# EAGLE design 8x8 (EAGLE 5.10)

## Sheet 1 of 5
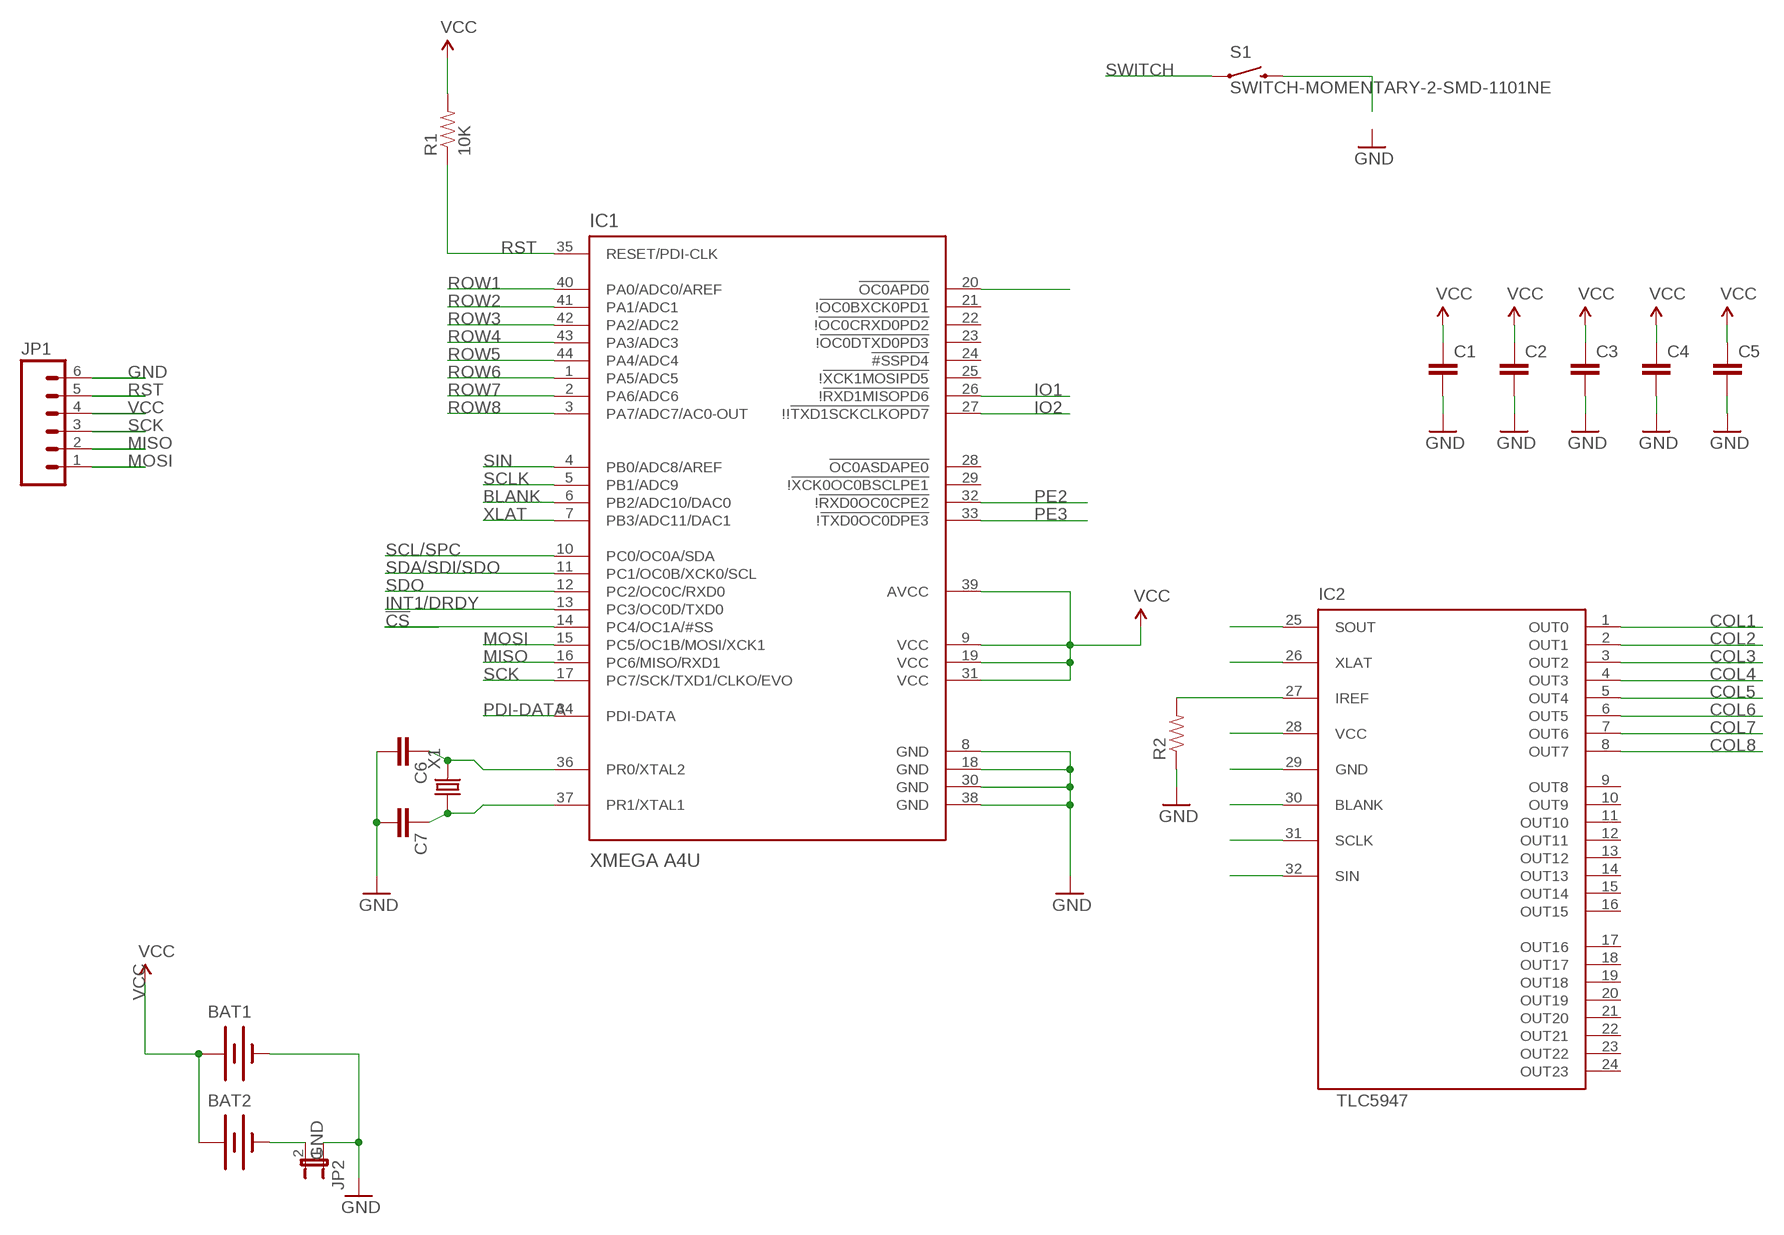
[diagram p0: schematic, sheet 1]

### Parts
BAT1  BATTERY245MM  [BATTCON_245MM]
BAT2  BATTERYCR123A  [BATTERY_CR123A]
C1  CAP0805  [0805]
C2  CAP0805  [0805]
C3  CAP0805  [0805]
C4  CAP0805  [0805]
C5  CAP0805  [0805]
C6  CAP0805  [0805]
C7  CAP0805  [0805]
IC1  XMEGA A4U  AT-XMEGA-XXA4-AU  [QFP80P1200X1200X120-44N]
IC2  TLC5947  [QFN32]
JP1  M061X06-SMD_EDGE_FEMALE  [1X06-SMD_EDGE]
JP2  JUMPER-2SMD-NO  [SJ_2S-NO]
R1  10K  RESISTOR0603-RES  [0603-RES]
R2  RESISTOR0603-RES  [0603-RES]
S1  SWITCH-MOMENTARY-2-SMD-1101NE  [TACTILE-SWITCH-1101NE]
X1  CRYSTAL-5032  [5032]

### Nets
!CS: IC1.14(PC4/OC1A/#SS) ; also sheet 4
BLANK: IC1.6(PB2/ADC10/DAC0) IC2.30(BLANK)
COL1: IC2.1(OUT0) ; also sheet 2
COL2: IC2.2(OUT1) ; also sheet 2
COL3: IC2.3(OUT2) ; also sheet 2
COL4: IC2.4(OUT3) ; also sheet 2
COL5: IC2.5(OUT4) ; also sheet 2
COL6: IC2.6(OUT5) ; also sheet 2
COL7: IC2.7(OUT6) ; also sheet 2
COL8: IC2.8(OUT7) ; also sheet 2
GND: BAT1.2(-) C1.2 C2.2 C3.2 C4.2 C5.2 C6.2 C7.2 IC1.8(GND) IC1.18(GND) IC1.30(GND) IC1.38(GND) IC2.29(GND) JP1.6 JP2.1 R2.1 ; also sheet 3,4,5
INT1/DRDY: IC1.13(PC3/OC0D/TXD0) ; also sheet 4
IO1: IC1.26(!!RXD1MISOPD6) ; also sheet 3
IO2: IC1.27(!!!TXD1SCKCLKOPD7) ; also sheet 3
IREF: IC2.27(IREF) R2.2
MISO: IC1.16(PC6/MISO/RXD1) JP1.2
MOSI: IC1.15(PC5/OC1B/MOSI/XCK1) JP1.1
N$1: BAT2.- JP2.2
N$5: S1.P$2
N$7: C6.1 IC1.36(PR0/XTAL2) X1.2
N$8: C7.1 IC1.37(PR1/XTAL1) X1.1
PDI-DATA: IC1.34(PDI-DATA)
PE2: IC1.32(!!RXD0OC0CPE2)
PE3: IC1.33(!!TXD0OC0DPE3)
ROW1: IC1.40(PA0/ADC0/AREF) ; also sheet 2
ROW2: IC1.41(PA1/ADC1) ; also sheet 2
ROW3: IC1.42(PA2/ADC2) ; also sheet 2
ROW4: IC1.43(PA3/ADC3) ; also sheet 2
ROW5: IC1.44(PA4/ADC4) ; also sheet 2
ROW6: IC1.1(PA5/ADC5) ; also sheet 2
ROW7: IC1.2(PA6/ADC6) ; also sheet 2
ROW8: IC1.3(PA7/ADC7/AC0-OUT) ; also sheet 2
RST: IC1.35(RESET/PDI-CLK) JP1.5 R1.1
SCK: IC1.17(PC7/SCK/TXD1/CLKO/EVO) JP1.3
SCL/SPC: IC1.10(PC0/OC0A/SDA) ; also sheet 4
SCLK: IC1.5(PB1/ADC9) IC2.31(SCLK)
SDA/SDI/SDO: IC1.11(PC1/OC0B/XCK0/SCL) ; also sheet 4
SDO: IC1.12(PC2/OC0C/RXD0) ; also sheet 4
SIN: IC1.4(PB0/ADC8/AREF) IC2.32(SIN)
SOUT: IC2.25(SOUT)
SWITCH: IC1.20(!OC0APD0) S1.P$1
VCC: BAT1.1(+) BAT2.+ C1.1 C2.1 C3.1 C4.1 C5.1 IC1.9(VCC) IC1.19(VCC) IC1.31(VCC) IC1.39(AVCC) IC2.28(VCC) JP1.4 R1.2 ; also sheet 2,3,4,5
XLAT: IC1.7(PB3/ADC11/DAC1) IC2.26(XLAT)
Unconnected: IC1.21(!!OC0BXCK0PD1) IC1.22(!!OC0CRXD0PD2) IC1.23(!!OC0DTXD0PD3) IC1.24(!#SSPD4) IC1.25(!!XCK1MOSIPD5) IC1.28(!OC0ASDAPE0) IC1.29(!!XCK0OC0BSCLPE1) IC2.9(OUT8) IC2.10(OUT9) IC2.11(OUT10) IC2.12(OUT11) IC2.13(OUT12) IC2.14(OUT13) IC2.15(OUT14) IC2.16(OUT15) IC2.17(OUT16) IC2.18(OUT17) IC2.19(OUT18) IC2.20(OUT19) IC2.21(OUT20) IC2.22(OUT21) IC2.23(OUT22) IC2.24(OUT23)

## Sheet 2 of 5
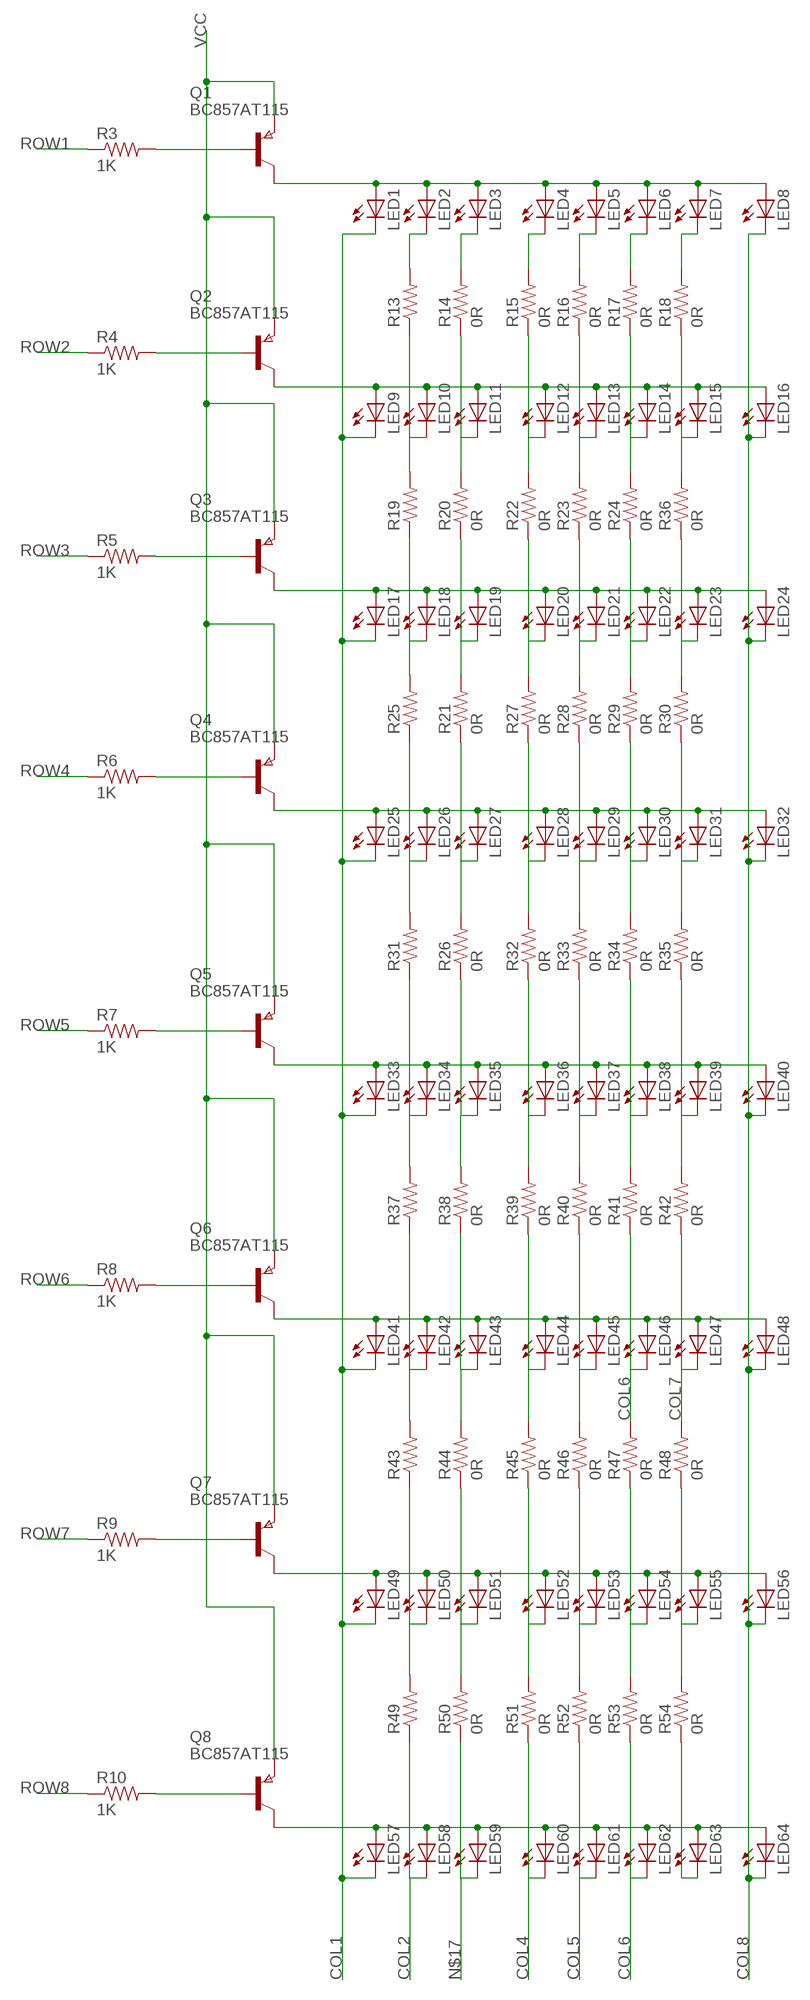
[diagram p1: schematic, sheet 2]

### Parts
LED1  LEDCHIPLED_1206  [CHIPLED_1206]
LED2  LEDCHIPLED_1206  [CHIPLED_1206]
LED3  LEDCHIPLED_1206  [CHIPLED_1206]
LED4  LEDCHIPLED_1206  [CHIPLED_1206]
LED5  LEDCHIPLED_1206  [CHIPLED_1206]
LED6  LEDCHIPLED_1206  [CHIPLED_1206]
LED7  LEDCHIPLED_1206  [CHIPLED_1206]
LED8  LEDCHIPLED_1206  [CHIPLED_1206]
LED9  LEDCHIPLED_1206  [CHIPLED_1206]
LED10  LEDCHIPLED_1206  [CHIPLED_1206]
LED11  LEDCHIPLED_1206  [CHIPLED_1206]
LED12  LEDCHIPLED_1206  [CHIPLED_1206]
LED13  LEDCHIPLED_1206  [CHIPLED_1206]
LED14  LEDCHIPLED_1206  [CHIPLED_1206]
LED15  LEDCHIPLED_1206  [CHIPLED_1206]
LED16  LEDCHIPLED_1206  [CHIPLED_1206]
LED17  LEDCHIPLED_1206  [CHIPLED_1206]
LED18  LEDCHIPLED_1206  [CHIPLED_1206]
LED19  LEDCHIPLED_1206  [CHIPLED_1206]
LED20  LEDCHIPLED_1206  [CHIPLED_1206]
LED21  LEDCHIPLED_1206  [CHIPLED_1206]
LED22  LEDCHIPLED_1206  [CHIPLED_1206]
LED23  LEDCHIPLED_1206  [CHIPLED_1206]
LED24  LEDCHIPLED_1206  [CHIPLED_1206]
LED25  LEDCHIPLED_1206  [CHIPLED_1206]
LED26  LEDCHIPLED_1206  [CHIPLED_1206]
LED27  LEDCHIPLED_1206  [CHIPLED_1206]
LED28  LEDCHIPLED_1206  [CHIPLED_1206]
LED29  LEDCHIPLED_1206  [CHIPLED_1206]
LED30  LEDCHIPLED_1206  [CHIPLED_1206]
LED31  LEDCHIPLED_1206  [CHIPLED_1206]
LED32  LEDCHIPLED_1206  [CHIPLED_1206]
LED33  LEDCHIPLED_1206  [CHIPLED_1206]
LED34  LEDCHIPLED_1206  [CHIPLED_1206]
LED35  LEDCHIPLED_1206  [CHIPLED_1206]
LED36  LEDCHIPLED_1206  [CHIPLED_1206]
LED37  LEDCHIPLED_1206  [CHIPLED_1206]
LED38  LEDCHIPLED_1206  [CHIPLED_1206]
LED39  LEDCHIPLED_1206  [CHIPLED_1206]
LED40  LEDCHIPLED_1206  [CHIPLED_1206]
LED41  LEDCHIPLED_1206  [CHIPLED_1206]
LED42  LEDCHIPLED_1206  [CHIPLED_1206]
LED43  LEDCHIPLED_1206  [CHIPLED_1206]
LED44  LEDCHIPLED_1206  [CHIPLED_1206]
LED45  LEDCHIPLED_1206  [CHIPLED_1206]
LED46  LEDCHIPLED_1206  [CHIPLED_1206]
LED47  LEDCHIPLED_1206  [CHIPLED_1206]
LED48  LEDCHIPLED_1206  [CHIPLED_1206]
LED49  LEDCHIPLED_1206  [CHIPLED_1206]
LED50  LEDCHIPLED_1206  [CHIPLED_1206]
LED51  LEDCHIPLED_1206  [CHIPLED_1206]
LED52  LEDCHIPLED_1206  [CHIPLED_1206]
LED53  LEDCHIPLED_1206  [CHIPLED_1206]
LED54  LEDCHIPLED_1206  [CHIPLED_1206]
LED55  LEDCHIPLED_1206  [CHIPLED_1206]
LED56  LEDCHIPLED_1206  [CHIPLED_1206]
LED57  LEDCHIPLED_1206  [CHIPLED_1206]
LED58  LEDCHIPLED_1206  [CHIPLED_1206]
LED59  LEDCHIPLED_1206  [CHIPLED_1206]
LED60  LEDCHIPLED_1206  [CHIPLED_1206]
LED61  LEDCHIPLED_1206  [CHIPLED_1206]
LED62  LEDCHIPLED_1206  [CHIPLED_1206]
LED63  LEDCHIPLED_1206  [CHIPLED_1206]
LED64  LEDCHIPLED_1206  [CHIPLED_1206]
Q1  BC857AT115  PNPSOT323SOT416  [SOT416]
Q2  BC857AT115  PNPSOT323SOT416  [SOT416]
Q3  BC857AT115  PNPSOT323SOT416  [SOT416]
Q4  BC857AT115  PNPSOT323SOT416  [SOT416]
Q5  BC857AT115  PNPSOT323SOT416  [SOT416]
Q6  BC857AT115  PNPSOT323SOT416  [SOT416]
Q7  BC857AT115  PNPSOT323SOT416  [SOT416]
Q8  BC857AT115  PNPSOT323SOT416  [SOT416]
R3  1K  SPARKFUN_RESISTOR  [SPARKFUN_0805]
R4  1K  SPARKFUN_RESISTOR  [SPARKFUN_0805]
R5  1K  SPARKFUN_RESISTOR  [SPARKFUN_0805]
R6  1K  SPARKFUN_RESISTOR  [SPARKFUN_0805]
R7  1K  SPARKFUN_RESISTOR  [SPARKFUN_0805]
R8  1K  SPARKFUN_RESISTOR0402-RES  [SPARKFUN_0402-RES]
R9  1K  SPARKFUN_RESISTOR  [SPARKFUN_0805]
R10  1K  SPARKFUN_RESISTOR  [SPARKFUN_0805]
R13  RESISTOR0603-RES  [0603-RES]
R14  0R  RESISTOR0603-RES  [0603-RES]
R15  0R  RESISTOR0603-RES  [0603-RES]
R16  0R  RESISTOR0603-RES  [0603-RES]
R17  0R  RESISTOR0603-RES  [0603-RES]
R18  0R  RESISTOR0603-RES  [0603-RES]
R19  RESISTOR0603-RES  [0603-RES]
R20  0R  RESISTOR0603-RES  [0603-RES]
R21  0R  RESISTOR0603-RES  [0603-RES]
R22  0R  RESISTOR0603-RES  [0603-RES]
R23  0R  RESISTOR0603-RES  [0603-RES]
R24  0R  RESISTOR0603-RES  [0603-RES]
R25  RESISTOR0603-RES  [0603-RES]
R26  0R  RESISTOR0603-RES  [0603-RES]
R27  0R  RESISTOR0603-RES  [0603-RES]
R28  0R  RESISTOR0603-RES  [0603-RES]
R29  0R  RESISTOR0603-RES  [0603-RES]
R30  0R  RESISTOR0603-RES  [0603-RES]
R31  RESISTOR0603-RES  [0603-RES]
R32  0R  RESISTOR0603-RES  [0603-RES]
R33  0R  RESISTOR0603-RES  [0603-RES]
R34  0R  RESISTOR0603-RES  [0603-RES]
R35  0R  RESISTOR0603-RES  [0603-RES]
R36  0R  RESISTOR0603-RES  [0603-RES]
R37  RESISTOR0603-RES  [0603-RES]
R38  0R  RESISTOR0603-RES  [0603-RES]
R39  0R  RESISTOR0603-RES  [0603-RES]
R40  0R  RESISTOR0603-RES  [0603-RES]
R41  0R  RESISTOR0603-RES  [0603-RES]
R42  0R  RESISTOR0603-RES  [0603-RES]
R43  RESISTOR0603-RES  [0603-RES]
R44  0R  RESISTOR0603-RES  [0603-RES]
R45  0R  RESISTOR0603-RES  [0603-RES]
R46  0R  RESISTOR0603-RES  [0603-RES]
R47  0R  RESISTOR0603-RES  [0603-RES]
R48  0R  RESISTOR0603-RES  [0603-RES]
R49  RESISTOR0603-RES  [0603-RES]
R50  0R  RESISTOR0603-RES  [0603-RES]
R51  0R  RESISTOR0603-RES  [0603-RES]
R52  0R  RESISTOR0603-RES  [0603-RES]
R53  0R  RESISTOR0603-RES  [0603-RES]
R54  0R  RESISTOR0603-RES  [0603-RES]

### Nets
COL1: LED1.C LED9.C LED17.C LED25.C LED33.C LED41.C LED49.C LED57.C ; also sheet 1
COL2: LED58.C R49.1 ; also sheet 1
COL3: LED3.C R14.2 ; also sheet 1
COL4: LED60.C R51.1 ; also sheet 1
COL5: LED61.C R52.1 ; also sheet 1
COL6: LED46.C LED62.C R41.1 R47.2 R53.1 ; also sheet 1
COL7: LED47.C LED63.C R42.1 R48.2 R54.1 ; also sheet 1
COL8: LED8.C LED16.C LED24.C LED32.C LED40.C LED48.C LED56.C LED64.C ; also sheet 1
LINE1: LED1.A LED2.A LED3.A LED4.A LED5.A LED6.A LED7.A LED8.A Q1.1(C)
LINE2: LED9.A LED10.A LED11.A LED12.A LED13.A LED14.A LED15.A LED16.A Q2.1(C)
LINE3: LED17.A LED18.A LED19.A LED20.A LED21.A LED22.A LED23.A LED24.A Q3.1(C)
LINE4: LED25.A LED26.A LED27.A LED28.A LED29.A LED30.A LED31.A LED32.A Q4.1(C)
LINE5: LED33.A LED34.A LED35.A LED36.A LED37.A LED38.A LED39.A LED40.A Q5.1(C)
LINE6: LED41.A LED42.A LED43.A LED44.A LED45.A LED46.A LED47.A LED48.A Q6.1(C)
LINE7: LED49.A LED50.A LED51.A LED52.A LED53.A LED54.A LED55.A LED56.A Q7.1(C)
LINE8: LED57.A LED58.A LED59.A LED60.A LED61.A LED62.A LED63.A LED64.A Q8.1(C)
N$2: Q1.2(B) R3.2
N$6: Q2.2(B) R4.2
N$9: LED2.C R13.2
N$10: LED10.C R13.1 R19.2
N$12: LED18.C R19.1 R25.2
N$13: LED26.C R25.1 R31.2
N$14: LED34.C R31.1 R37.2
N$15: LED42.C R37.1 R43.2
N$16: LED50.C R43.1 R49.2
N$17: LED59.C R50.1
N$18: LED51.C R44.1 R50.2
N$19: LED43.C R38.1 R44.2
N$20: LED35.C R26.1 R38.2
N$21: LED27.C R21.1 R26.2
N$22: LED19.C R20.1 R21.2
N$23: Q3.2(B) R5.2
N$24: LED11.C R14.1 R20.2
N$25: LED4.C R15.2
N$26: LED12.C R15.1 R22.2
N$27: LED20.C R22.1 R27.2
N$28: LED28.C R27.1 R32.2
N$29: LED36.C R32.1 R39.2
N$30: LED44.C R39.1 R45.2
N$31: LED52.C R45.1 R51.2
N$32: LED5.C R16.2
N$33: LED13.C R16.1 R23.2
N$34: Q4.2(B) R6.2
N$35: LED21.C R23.1 R28.2
N$36: LED29.C R28.1 R33.2
N$37: LED37.C R33.1 R40.2
N$38: LED45.C R40.1 R46.2
N$39: LED53.C R46.1 R52.2
N$40: LED6.C R17.2
N$41: LED14.C R17.1 R24.2
N$42: LED22.C R24.1 R29.2
N$43: LED30.C R29.1 R34.2
N$44: LED38.C R34.1 R41.2
N$45: Q5.2(B) R7.2
N$47: LED54.C R47.1 R53.2
N$48: LED7.C R18.2
N$49: LED15.C R18.1 R36.2
N$50: LED23.C R30.2 R36.1
N$51: LED31.C R30.1 R35.2
N$52: LED39.C R35.1 R42.2
N$54: LED55.C R48.1 R54.2
N$56: Q6.2(B) R8.2
N$67: Q7.2(B) R9.2
N$78: Q8.2(B) R10.2
ROW1: R3.1 ; also sheet 1
ROW2: R4.1 ; also sheet 1
ROW3: R5.1 ; also sheet 1
ROW4: R6.1 ; also sheet 1
ROW5: R7.1 ; also sheet 1
ROW6: R8.1 ; also sheet 1
ROW7: R9.1 ; also sheet 1
ROW8: R10.1 ; also sheet 1
VCC: Q1.3(E) Q2.3(E) Q3.3(E) Q4.3(E) Q5.3(E) Q6.3(E) Q7.3(E) Q8.3(E) ; also sheet 1,3,4,5

## Sheet 3 of 5
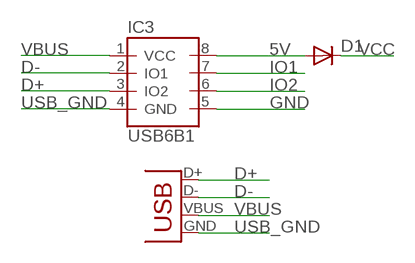
[diagram p2: schematic, sheet 3]

### Parts
D1  DIODESMA  [SMA-DIODE]
IC3  USB6B1  [SO08]
USB1  USB-SMD-NS  [USB-MINIB-NOSTOP]

### Nets
5V: D1.A IC3.8(VCC)
D+: IC3.3(IO2) USB1.D+
D-: IC3.2(IO1) USB1.D-
GND: IC3.5(GND) ; also sheet 1,4,5
IO1: IC3.7(IO1) ; also sheet 1
IO2: IC3.6(IO2) ; also sheet 1
USB_GND: IC3.4(GND) USB1.GND
VBUS: IC3.1(VCC) USB1.VBUS
VCC: D1.C ; also sheet 1,2,4,5

## Sheet 4 of 5
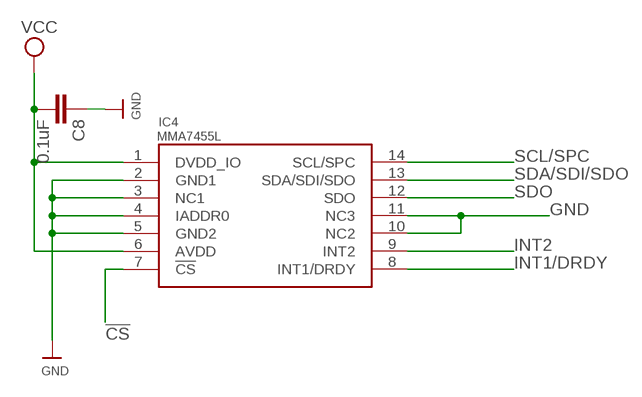
[diagram p3: schematic, sheet 4]

### Parts
C8  0.1uF  CAP0805  [0805]
IC4  MMA7455L  [LGA-14]

### Nets
!CS: IC4.7(!CS) ; also sheet 1
GND: C8.1 IC4.2(GND1) IC4.3(NC1) IC4.4(IADDR0) IC4.5(GND2) IC4.10(NC2) IC4.11(NC3) ; also sheet 1,3,5
INT1/DRDY: IC4.8(INT1/DRDY) ; also sheet 1
INT2: IC4.9(INT2)
SCL/SPC: IC4.14(SCL/SPC) ; also sheet 1
SDA/SDI/SDO: IC4.13(SDA/SDI/SDO) ; also sheet 1
SDO: IC4.12(SDO) ; also sheet 1
VCC: C8.2 IC4.1(DVDD_IO) IC4.6(AVDD) ; also sheet 1,2,3,5

## Sheet 5 of 5
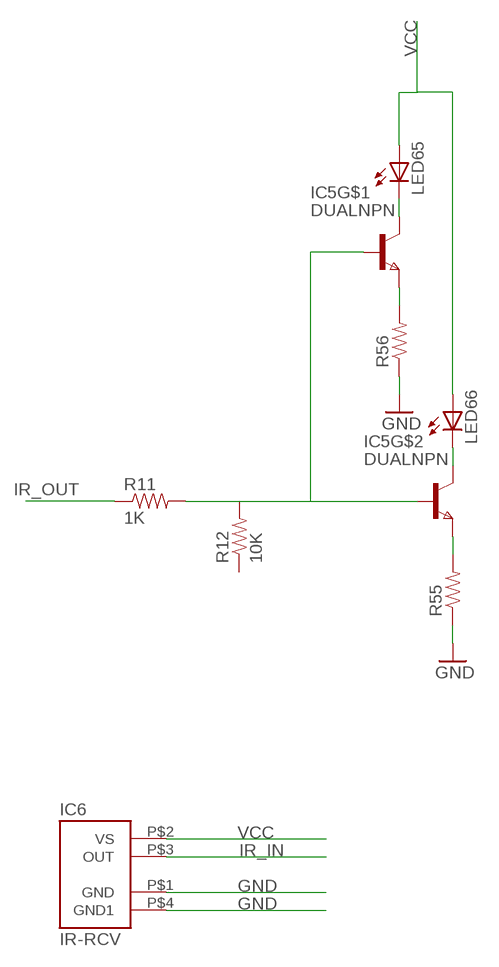
[diagram p4: schematic, sheet 5]

### Parts
IC5  DUALNPN  [SSOT6]
IC6  IR-RCV  [IR-RCV]
LED65  LEDREVERSE_GULLWING  [REVERSE_GULL_LED]
LED66  LEDREVERSE_GULLWING  [REVERSE_GULL_LED]
R11  1K  RESISTOR0603-RES  [0603-RES]
R12  10K  RESISTOR0603-RES  [0603-RES]
R55  RESISTOR0603-RES  [0603-RES]
R56  RESISTOR0603-RES  [0603-RES]

### Nets
GND: IC6.P$1(GND) IC6.P$4(GND1) R55.1 R56.1 ; also sheet 1,3,4
IR_IN: IC6.P$3(OUT)
IR_OUT: R11.1
N$3: IC5.1(B) IC5.3(B) R11.2 R12.2
N$4: IC5.4(C) LED66.C
N$11: IC5.6(C) LED65.C
N$55: IC5.5(E) R56.2
N$57: IC5.2(E) R55.2
VCC: IC6.P$2(VS) LED65.A LED66.A ; also sheet 1,2,3,4
Unconnected: R12.1

## Library data of the parts
BAT1 BAT2 = SparkFun:BATTERY: Battery Holders Various common sizes : AA, AAA, 20mm coin cell and 12mm coin cell.
C1-C8 = SparkFun:CAP: Capacitor Standard 0603 ceramic capacitor, and 0.1" leaded capacitor.
D1 = SparkFun:DIODE: Diode These are standard reverse protection diodes and small signal diodes. SMA package can handle up to about 1A. SOD-323 can handle about 200mA. What the SOD-323 package when ordering, there are some mfgs out there that are 5-pin packages.
IC1 = xmega-a4:AT-XMEGA-XXA4-AU: ATxMega a4 Serie
IC2 = slice:TLC5947
IC3 = st-microelectronics:USB6B1: DATA LINES PROTECTION Source: http://www.st.com/stonline/products/literature/ds/5605.pdf; MPN: USB6B1; OC_FARNELL: 9804358; OC_NEWARK: 26M4750
IC4 = MMA7455Lbreakoutboard-v1a:MMA7455L
IC5 = 8x8:DUALNPN
IC6 = 8x8:IR-RCV
JP1 = SparkFun:M06: Header 6 Standard 6-pin 0.1" header. Use with straight break away headers (SKU : PRT-00116), right angle break away headers (PRT-00553), swiss pins (PRT-00743), machine pins (PRT-00117), and female headers (PRT-00115). Molex polarized connector foot print use with SKU : PRT-08094 with associated crimp pins and housings. NOTES ON THE VARIANTS LOCK and LOCK_LONGPADS... This footprint was designed to help hold the alignment of a through-hole component (i.e. 6-pin header) while soldering it into place. You may notice that each hole has been shifted either up or down by 0.005 of an inch from it's more standard position (which is a perfectly straight line). This slight alteration caused the pins (the squares in the middle) to touch the edges of the holes. Because they are alternating, it causes a "brace" to hold the component in place. 0.005 has proven to be the perfect amount of "off-center" position when using our standard breakaway headers. Although looks a little odd when you look at the bare footprint, once you have a header in there, the alteration is very hard to notice. Also, if you push a header all the way into place, it is covered up entirely on the bottom side. This idea of altering the position of holes to aid alignment will be further integrated into the Sparkfun Library for other footprints. It can help hold any component with 3 or more connection pins.
JP2 = SparkFun:JUMPER-2: Jumper Basic 0.1" spaced jumper. Use with breakaway headers.
LED1-LED64 = led:LED: LED OSRAM: - CHIPLED LG R971, LG N971, LY N971, LG Q971, LY Q971, LO R971, LY R971 LH N974, LH R974 LS Q976, LO Q976, LY Q976 LO Q996 - Hyper CHIPLED LW Q18S LB Q993, LB Q99A, LB R99A - SideLED LS A670, LO A670, LY A670, LG A670, LP A670 LB A673, LV A673, LT A673, LW A673 LH A674 LY A675 LS A676, LA A676, LO A676, LY A676, LW A676 LS A679, LY A679, LG A679 - Hyper Micro SIDELED® LS Y876, LA Y876, LO Y876, LY Y876 LT Y87S - SmartLED LW L88C, LW L88S LB L89C, LB L89S, LG L890 LS L89K, LO L89K, LY L89K LS L896, LA L896, LO L896, LY L896 - TOPLED LS T670, LO T670, LY T670, LG T670, LP T670 LSG T670, LSP T670, LSY T670, LOP T670, LYG T670 LG T671, LOG T671, LSG T671 LB T673, LV T673, LT T673, LW T673 LH T674 LS T676, LA T676, LO T676, LY T676, LB T676, LH T676, LSB T676, LW T676 LB T67C, LV T67C, LT T67C, LS T67K, LO T67K, LY T67K, LW E67C LS E67B, LA E67B, LO E67B, LY E67B, LB E67C, LV E67C, LT E67C LW T67C LS T679, LY T679, LG T679 LS T770, LO T770, LY T770, LG T770, LP T770 LB T773, LV T773, LT T773, LW T773 LH T774 LS E675, LA E675, LY E675, LS T675 LS T776, LA T776, LO T776, LY T776, LB T776 LHGB T686 LT T68C, LB T68C - Hyper Mini TOPLED® LB M676 - Mini TOPLED Santana® LG M470 LS M47K, LO M47K, LY M47K Source: http://www.osram.convergy.de LUXEON: - LUMILED® LXK2-PW12-R00, LXK2-PW12-S00, LXK2-PW14-U00, LXK2-PW14-V00 LXK2-PM12-R00, LXK2-PM12-S00, LXK2-PM14-U00 LXK2-PE12-Q00, LXK2-PE12-R00, LXK2-PE12-S00, LXK2-PE14-T00, LXK2-PE14-U00 LXK2-PB12-K00, LXK2-PB12-L00, LXK2-PB12-M00, LXK2-PB14-N00, LXK2-PB14-P00, LXK2-PB14-Q00 LXK2-PR12-L00, LXK2-PR12-M00, LXK2-PR14-Q00, LXK2-PR14-R00 LXK2-PD12-Q00, LXK2-PD12-R00, LXK2-PD12-S00 LXK2-PH12-R00, LXK2-PH12-S00 LXK2-PL12-P00, LXK2-PL12-Q00, LXK2-PL12-R00 Source: www.luxeon.com KINGBRIGHT: KA-3528ASYC Source: www.kingbright.com
LED65 LED66 = 8x8:LED: LED OSRAM: - CHIPLED LG R971, LG N971, LY N971, LG Q971, LY Q971, LO R971, LY R971 LH N974, LH R974 LS Q976, LO Q976, LY Q976 LO Q996 - Hyper CHIPLED LW Q18S LB Q993, LB Q99A, LB R99A - SideLED LS A670, LO A670, LY A670, LG A670, LP A670 LB A673, LV A673, LT A673, LW A673 LH A674 LY A675 LS A676, LA A676, LO A676, LY A676, LW A676 LS A679, LY A679, LG A679 - Hyper Micro SIDELED® LS Y876, LA Y876, LO Y876, LY Y876 LT Y87S - SmartLED LW L88C, LW L88S LB L89C, LB L89S, LG L890 LS L89K, LO L89K, LY L89K LS L896, LA L896, LO L896, LY L896 - TOPLED LS T670, LO T670, LY T670, LG T670, LP T670 LSG T670, LSP T670, LSY T670, LOP T670, LYG T670 LG T671, LOG T671, LSG T671 LB T673, LV T673, LT T673, LW T673 LH T674 LS T676, LA T676, LO T676, LY T676, LB T676, LH T676, LSB T676, LW T676 LB T67C, LV T67C, LT T67C, LS T67K, LO T67K, LY T67K, LW E67C LS E67B, LA E67B, LO E67B, LY E67B, LB E67C, LV E67C, LT E67C LW T67C LS T679, LY T679, LG T679 LS T770, LO T770, LY T770, LG T770, LP T770 LB T773, LV T773, LT T773, LW T773 LH T774 LS E675, LA E675, LY E675, LS T675 LS T776, LA T776, LO T776, LY T776, LB T776 LHGB T686 LT T68C, LB T68C - Hyper Mini TOPLED® LB M676 - Mini TOPLED Santana® LG M470 LS M47K, LO M47K, LY M47K Source: http://www.osram.convergy.de LUXEON: - LUMILED® LXK2-PW12-R00, LXK2-PW12-S00, LXK2-PW14-U00, LXK2-PW14-V00 LXK2-PM12-R00, LXK2-PM12-S00, LXK2-PM14-U00 LXK2-PE12-Q00, LXK2-PE12-R00, LXK2-PE12-S00, LXK2-PE14-T00, LXK2-PE14-U00 LXK2-PB12-K00, LXK2-PB12-L00, LXK2-PB12-M00, LXK2-PB14-N00, LXK2-PB14-P00, LXK2-PB14-Q00 LXK2-PR12-L00, LXK2-PR12-M00, LXK2-PR14-Q00, LXK2-PR14-R00 LXK2-PD12-Q00, LXK2-PD12-R00, LXK2-PD12-S00 LXK2-PH12-R00, LXK2-PH12-S00 LXK2-PL12-P00, LXK2-PL12-Q00, LXK2-PL12-R00 Source: www.luxeon.com KINGBRIGHT: KA-3528ASYC Source: www.kingbright.com
Q1-Q8 = zetex:PNPSOT323: PNP TRANSISTOR
R1 R2 R55 R56 = SparkFun:RESISTOR: Resistor Basic schematic elements and footprints for 0603, 1206, and PTH 1/10th watt (small) resistors.
R3-R10 = Nullspace:SPARKFUN_RESISTOR: Resistor Basic schematic elements and footprints for 0603, 1206, and PTH 1/10th watt (small) resistors.
R11-R54 = 8x8:RESISTOR: Resistor Basic schematic elements and footprints for 0603, 1206, and PTH 1/10th watt (small) resistors.
S1 = NSL_RFIDdle:SWITCH-MOMENTARY-2
USB1 = SparkFun:USB: USB Connectors USB-B-PTH is fully proven SKU : PRT-00139 USB-miniB is fully proven SKU : PRT-00587 USB-A-PCB is untested. USB-A-H is throughly reviewed, but untested. Spark Fun Electronics SKU : PRT-00437 USB-B-SMT is throughly reviewed, but untested. Needs silkscreen touching up. USB-A-S has not been used/tested USB-MB-H has not been used/tested
X1 = NSL_MiniQuad:CRYSTAL*: CRYSTAL

## Net classes
1 power: width 0.254 mm
2 leds: width 0.508 mm

## Board
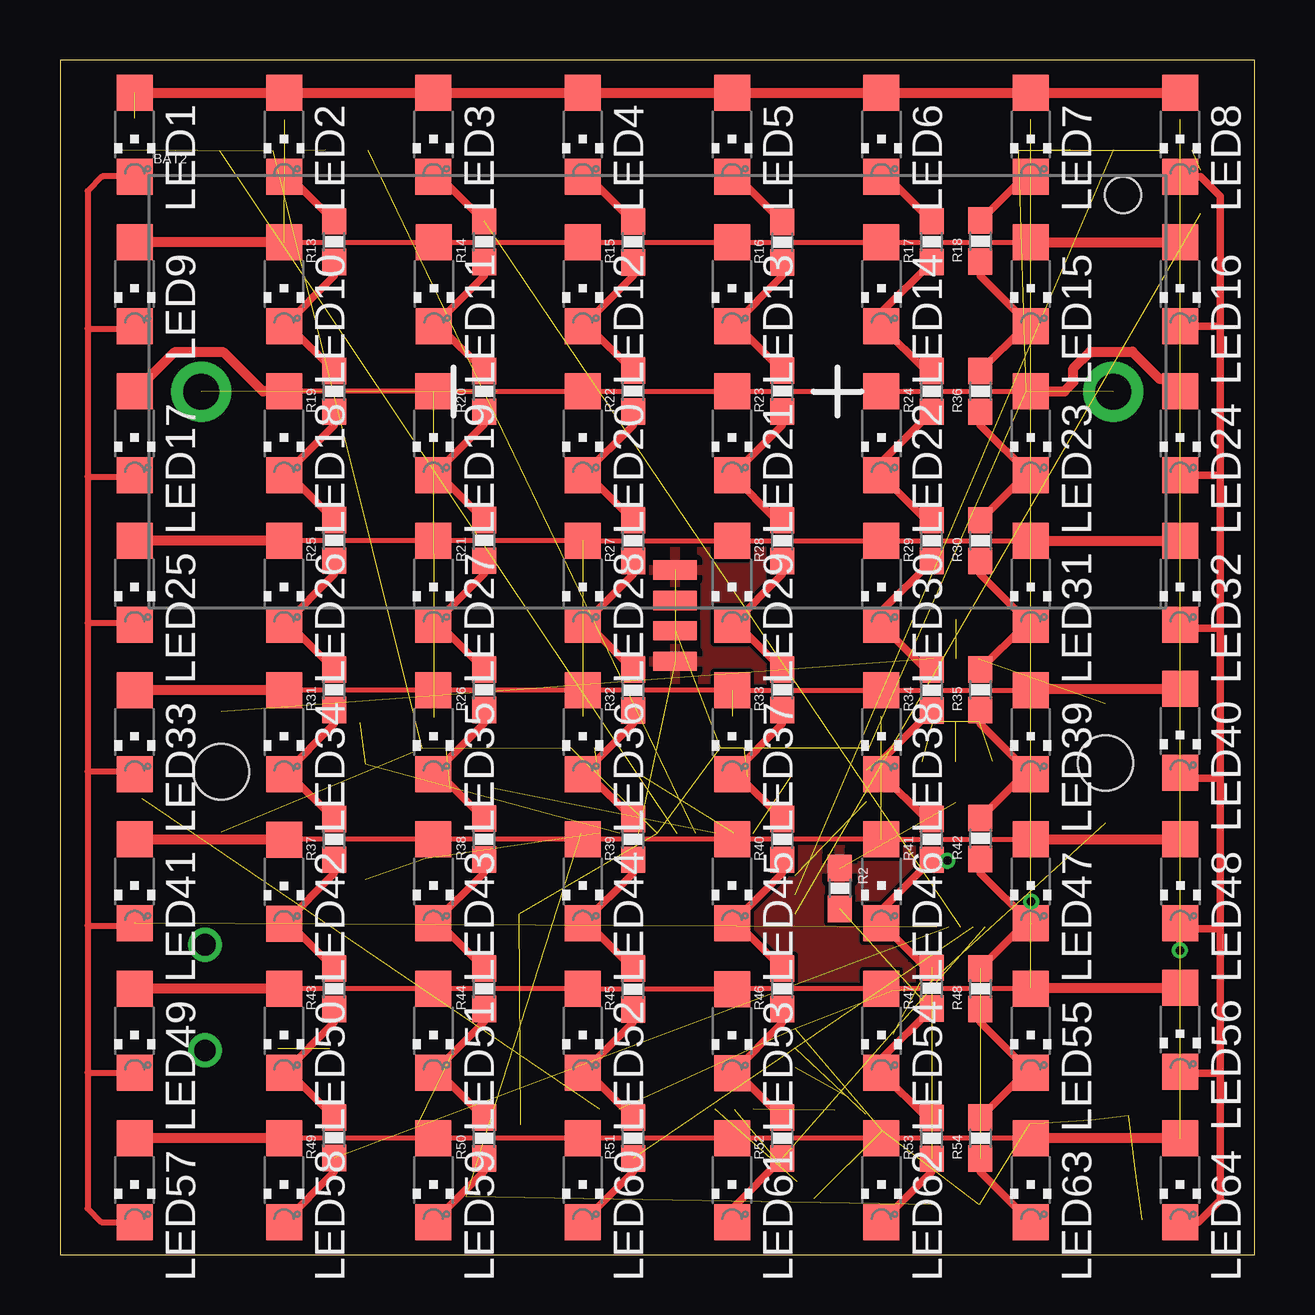
[diagram p5: board, top side]
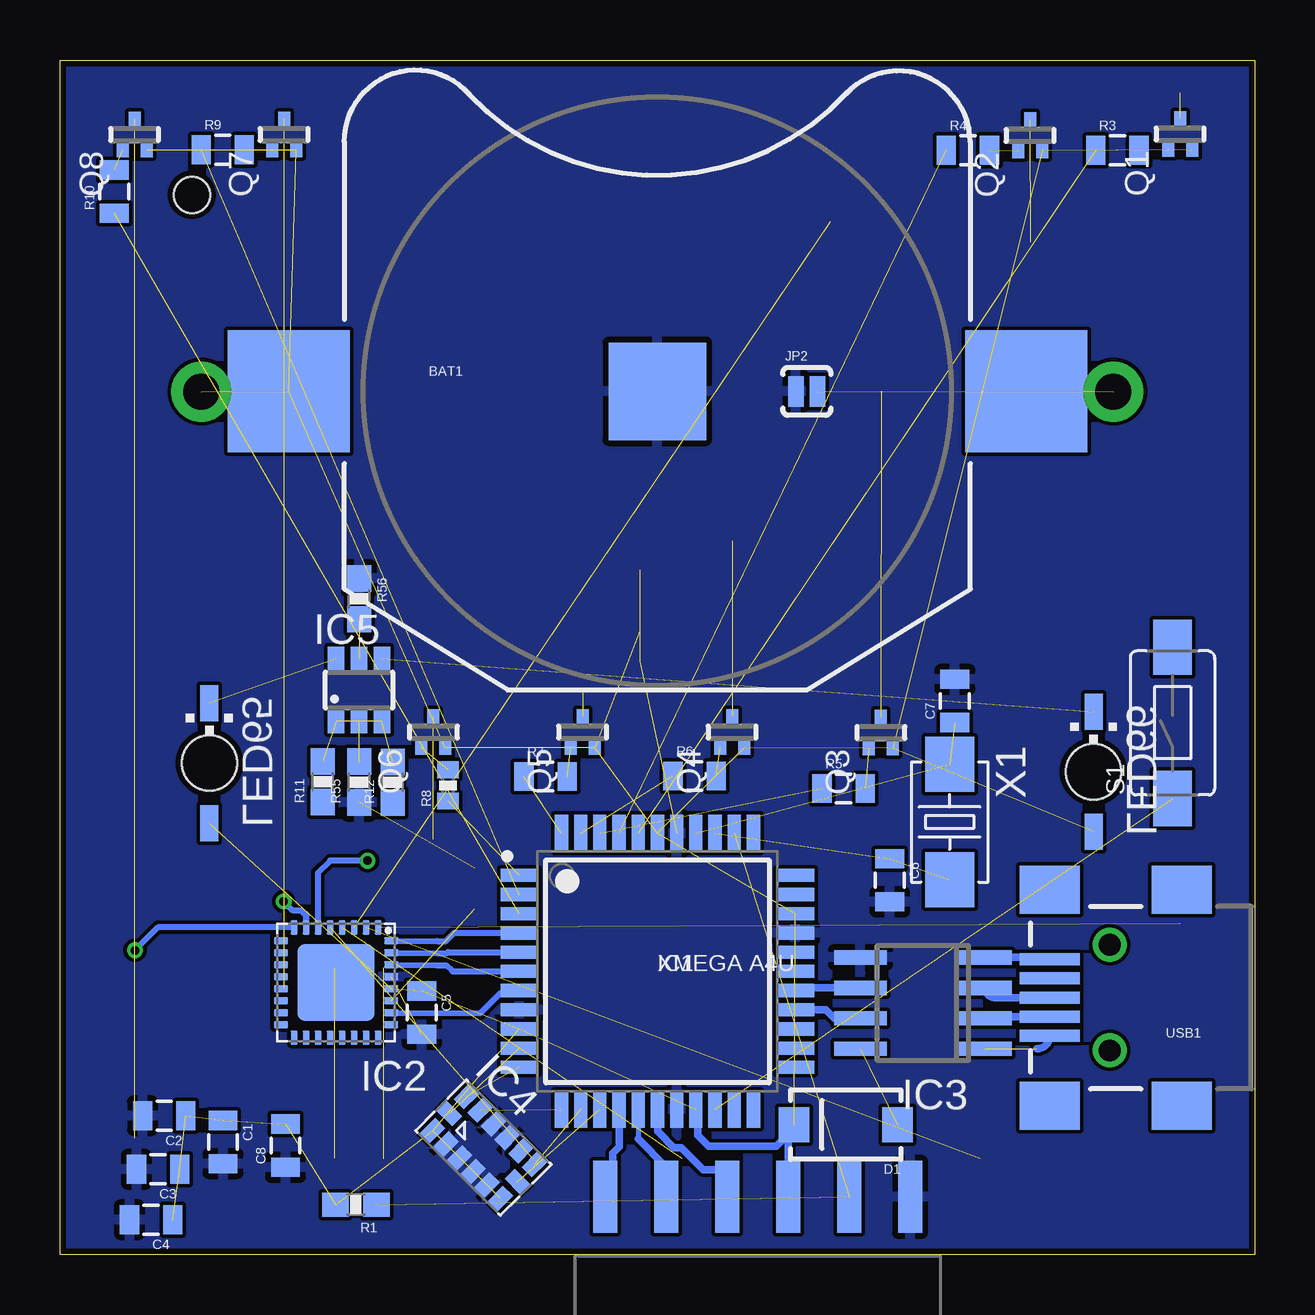
[diagram p6: board, bottom side, seen from below]

Size 49.78 x 49.78 mm. Coordinates in mm from the lower left corner, seen from the top.
Outline: 49.78,49.78 0,49.78 0,0 49.78,0 49.78,49.78
Copper layers (1*16): Top 0.035mm / dielectric 1.5mm / Bottom 0.035mm
Design rules "ITead_rule": minimum track width 6mil, minimum drill 12mil, track to track 6mil, track to pad 6mil, pad to pad 6mil, via to via 6mil, smd to smd 0mil, copper to edge 10mil, drill to drill 10mil, minimum pad ring 10mil, minimum via ring 6mil, stop-mask expansion 2mil, vias tented up to drill 100mil, thermal gap 10mil

### Footprints (pad centres in the part's own frame; a part is rotated, then mirrored left to right if it is on the bottom)
BATTCON_245MM = smd 5.08 x 5.08: 1 -15.367,0; 3 15.367,0 | smd 4.064 x 4.064: 2 0,0
BATTERY_CR123A = drill 1.5 pad 2.5 round: + 19,0; - -19,0 | hole 1.5: 19.4,8.2
0805 = smd 0.8 x 1.2: 1 -0.9,0; 2 0.9,0
SMA-DIODE = smd 1.27 x 1.47: A -2.15,0; C 2.15,0
QFP80P1200X1200X120-44N = smd 1.55 x 0.55: 1 -5.75,4; 2 -5.75,3.2; 3 -5.75,2.4; 4 -5.75,1.6; 5 -5.75,0.8; 6 -5.75,0; 7 -5.75,-0.8; 8 -5.75,-1.6; 9 -5.75,-2.4; 10 -5.75,-3.2; 11 -5.75,-4; 23 5.75,-4; 24 5.75,-3.2; 25 5.75,-2.4; 26 5.75,-1.6; 27 5.75,-0.8; 28 5.75,0; 29 5.75,0.8; 30 5.75,1.6; 31 5.75,2.4; 32 5.75,3.2; 33 5.75,4 | smd 0.55 x 1.55: 12 -4,-5.75; 13 -3.2,-5.75; 14 -2.4,-5.75; 15 -1.6,-5.75; 16 -0.8,-5.75; 17 0,-5.75; 18 0.8,-5.75; 19 1.6,-5.75; 20 2.4,-5.75; 21 3.2,-5.75; 22 4,-5.75; 34 4,5.75; 35 3.2,5.75; 36 2.4,5.75; 37 1.6,5.75; 38 0.8,5.75; 39 0,5.75; 40 -0.8,5.75; 41 -1.6,5.75; 42 -2.4,5.75; 43 -3.2,5.75; 44 -4,5.75
QFN32 = smd 0.3 x 0.6: 1 -1.75,-2.3; 2 -1.25,-2.3; 3 -0.75,-2.3; 4 -0.25,-2.3; 5 0.25,-2.3; 6 0.75,-2.3; 7 1.25,-2.3; 8 1.75,-2.3; 17 1.75,2.3; 18 1.25,2.3; 19 0.75,2.3; 20 0.25,2.3; 21 -0.25,2.3; 22 -0.75,2.3; 23 -1.25,2.3; 24 -1.75,2.3 | smd 0.6 x 0.3: 9 2.3,-1.75; 10 2.3,-1.25; 11 2.3,-0.75; 12 2.3,-0.25; 13 2.3,0.25; 14 2.3,0.75; 15 2.3,1.25; 16 2.3,1.75; 25 -2.3,1.75; 26 -2.3,1.25; 27 -2.3,0.75; 28 -2.3,0.25; 29 -2.3,-0.25; 30 -2.3,-0.75; 31 -2.3,-1.25; 32 -2.3,-1.75 | smd 3.2 x 3.2: EXP 0,0
SO08 = smd 0.6 x 2.2: 1 -1.905,-2.6; 2 -0.635,-2.6; 3 0.635,-2.6; 4 1.905,-2.6; 5 1.905,2.6; 6 0.635,2.6; 7 -0.635,2.6; 8 -1.905,2.6
LGA-14 = smd 0.6 x 0.9: 1 -2,-1; 2 -1.2,-1; 3 -0.4,-1; 4 0.4,-1; 5 1.2,-1; 6 2,-1; 8 2,1; 9 1.2,1; 10 0.4,1; 11 -0.4,1; 12 -1.2,1; 13 -2,1 | smd 0.9 x 0.6: 7 2,0; 14 -2,0
SSOT6 = smd 0.69 x 0.99: 1 -0.95,-1.3; 2 0,-1.3; 3 0.95,-1.3; 4 0.95,1.3; 5 0,1.3; 6 -0.95,1.3
IR-RCV = smd 0.8 x 1.8: P$1 -1.905,0; P$2 -0.635,0; P$3 0.635,0; P$4 1.905,0
1X06-SMD_EDGE = smd 1 x 3: 1 0,-0.08; 2 2.54,-0.08; 3 5.08,-0.08; 4 7.62,-0.08; 5 10.16,-0.08; 6 12.7,-0.08
SJ_2S-NO = smd 0.635 x 1.27: 1 -0.45,0; 2 0.45,0
CHIPLED_1206 = smd 1.5 x 1.5: A 0,-1.75; C 0,1.75
REVERSE_GULL_LED = smd 0.75 x 1.5 bottom: A 0,-2.5; C 0,2.5 | hole 2.3: 0,0
SOT416 = smd 0.6 x 0.5: 1 -0.65,0; 2 0.65,-0.5; 3 0.65,0.5
0603-RES = smd 1.1 x 1: 1 -0.85,0; 2 0.85,0
SPARKFUN_0805 = smd 0.8 x 1.2: 1 -0.9,0; 2 0.9,0
SPARKFUN_0402-RES = smd 0.7 x 0.9: 1 -0.65,0; 2 0.65,0
TACTILE-SWITCH-1101NE = smd 2.3 x 1.6: P$1 -3.15,0; P$2 3.15,0
USB-MINIB-NOSTOP = smd 2.5 x 0.5: D+ 2.5,0; D- 2.5,0.8; GND 2.5,-1.6; ID 2.5,-0.8; VBUS 2.5,1.6 | smd 2.5 x 2: G1 -3,-4.5; G2 -3,4.5; G3 2.5,4.5; G4 2.5,-4.5 | drill 0.9 pad 0.8 round: H1 0,2.2 | drill 0.9 pad 0.787 round: H2 0,-2.2
5032 = smd 2.286 x 2.032: 1 -2.413,0; 2 2.413,0

### Placement (x,y rotation side)
BAT1  24.89,35.98 0 bottom
BAT2  24.89,35.97 0 top
C1  42.99,4.7 270 bottom
C2  45.44,5.79 180 bottom
C3  45.69,3.57 180 bottom
C4  45.99,1.46 180 bottom
C5  34.71,10.1 270 bottom
C6  15.21,15.61 270 bottom
C7  12.5,23.08 90 bottom
C8  40.39,4.55 90 bottom
D1  17.04,5.42 180 bottom
IC1  24.89,11.81 0 bottom
IC2  38.28,11.34 180 bottom
IC3  13.83,10.49 90 bottom
IC4  32.14,4.47 315 bottom
IC5  37.33,23.53 0 bottom
IC6  25.63,26.63 90 top
JP1  27.06,2.49 0 bottom
JP2  18.67,35.98 0 bottom
LED1  3.11,46.67 180 top
LED2  9.33,46.67 180 top
LED3  15.56,46.67 180 top
LED4  21.78,46.67 180 top
LED5  28,46.67 180 top
LED6  34.23,46.67 180 top
LED7  40.45,46.67 180 top
LED8  46.67,46.67 180 top
LED9  3.11,40.45 180 top
LED10  9.33,40.45 180 top
LED11  15.58,40.45 180 top
LED12  21.78,40.45 180 top
LED13  28,40.45 180 top
LED14  34.23,40.45 180 top
LED15  40.45,40.45 180 top
LED16  46.67,40.45 180 top
LED17  3.11,34.23 180 top
LED18  9.33,34.23 180 top
LED19  15.56,34.23 180 top
LED20  21.78,34.23 180 top
LED21  28,34.23 180 top
LED22  34.23,34.23 180 top
LED23  40.45,34.23 180 top
LED24  46.67,34.23 180 top
LED25  3.11,28 180 top
LED26  9.33,28 180 top
LED27  15.56,28 180 top
LED28  21.78,28 180 top
LED29  28,28 180 top
LED30  34.23,28 180 top
LED31  40.45,28 180 top
LED32  46.67,28 180 top
LED33  3.11,21.78 180 top
LED34  9.33,21.78 180 top
LED35  15.56,21.78 180 top
LED36  21.78,21.78 180 top
LED37  28,21.78 180 top
LED38  34.23,21.78 180 top
LED39  40.45,21.78 180 top
LED40  46.67,21.83 180 top
LED41  3.11,15.56 180 top
LED42  9.33,15.54 180 top
LED43  15.56,15.56 180 top
LED44  21.78,15.56 180 top
LED45  28,15.56 180 top
LED46  34.23,15.56 180 top
LED47  40.45,15.56 180 top
LED48  46.69,15.56 180 top
LED49  3.11,9.33 180 top
LED50  9.33,9.33 180 top
LED51  15.56,9.33 180 top
LED52  21.78,9.33 180 top
LED53  28,9.32 180 top
LED54  34.23,9.33 180 top
LED55  40.45,9.33 180 top
LED56  46.67,9.39 180 top
LED57  3.11,3.11 180 top
LED58  9.33,3.11 180 top
LED59  15.56,3.11 180 top
LED60  21.78,3.11 180 top
LED61  28,3.11 180 top
LED62  34.23,3.11 180 top
LED63  40.45,3.11 180 top
LED64  46.67,3.11 180 top
LED65  43.56,20.49 0 top
LED66  6.72,20.13 0 top
Q1  3.11,46.7 270 bottom
Q2  9.36,46.65 270 bottom
Q3  15.58,21.76 270 bottom
Q4  21.78,21.78 270 bottom
Q5  28,21.78 270 bottom
Q6  34.23,21.78 270 bottom
Q7  40.45,46.67 270 bottom
Q8  46.67,46.67 270 bottom
R1  37.45,2.1 180 bottom
R2  32.5,15.27 270 top
R3  5.73,46.02 0 bottom
R4  11.95,46.02 0 bottom
R5  17.13,19.43 0 bottom
R6  23.34,19.95 0 bottom
R7  29.55,19.93 0 bottom
R8  33.62,19.56 90 bottom
R9  43,46.05 0 bottom
R10  47.52,44.3 90 bottom
R11  38.84,19.71 90 bottom
R12  35.93,19.68 90 bottom
R13  11.43,42.21 90 top
R14  17.68,42.21 90 top
R15  23.88,42.2 90 top
R16  30.1,42.19 90 top
R17  36.32,42.21 90 top
R18  38.35,42.24 90 top
R19  11.43,35.98 90 top
R20  17.68,35.98 90 top
R21  17.68,29.77 90 top
R22  23.88,35.99 90 top
R23  30.1,35.99 90 top
R24  36.32,35.98 90 top
R25  11.43,29.77 90 top
R26  17.68,23.55 90 top
R27  23.88,29.76 90 top
R28  30.1,29.76 90 top
R29  36.32,29.76 90 top
R30  38.35,29.76 90 top
R31  11.43,23.55 90 top
R32  23.88,23.53 90 top
R33  30.1,23.55 90 top
R34  36.32,23.53 90 top
R35  38.35,23.55 90 top
R36  38.35,35.98 90 top
R37  11.43,17.31 90 top
R38  17.68,17.32 90 top
R39  23.88,17.31 90 top
R40  30.1,17.31 90 top
R41  36.32,17.31 90 top
R42  38.35,17.35 90 top
R43  11.43,11.09 90 top
R44  17.68,11.09 90 top
R45  23.88,11.07 90 top
R46  30.1,11.09 90 top
R47  36.32,11.11 90 top
R48  38.35,11.09 90 top
R49  11.43,4.88 90 top
R50  17.68,4.86 90 top
R51  23.88,4.86 90 top
R52  30.1,4.86 90 top
R53  36.32,4.85 90 top
R54  38.35,4.86 90 top
R55  37.33,19.7 90 bottom
R56  37.33,27.33 270 bottom
S1  3.43,22.16 90 bottom
USB1  6.05,10.72 180 bottom
X1  12.71,18.03 270 bottom

### Tracks (layer width: path | path; a pad name or v marks a point on that pad's centre or on a via)
5V  (1 unrouted)
!CS  (1 unrouted)
BLANK
  Bottom 0.254: IC2.30 34.07,12.06 33.68,12.06 33.43,11.81 IC1.6
COL1  (1 unrouted)
  Top 0.254: LED1.C 3.1,44.93 1.77,44.93 1.16,44.32 1.16,38.59 | 1.16,38.59 1.16,32.42 | 1.16,32.42 1.16,26.33 | 1.16,26.33 1.16,20.14 | 1.16,20.14 1.16,13.72 | 1.16,13.72 1.16,7.59 | 1.16,7.59 1.16,1.93 1.72,1.36 LED57.C | LED49.C 3.1,7.59 1.16,7.59 | LED41.C 3.02,13.72 1.16,13.72 | LED33.C 3,20.14 1.16,20.14 | LED25.C 3.04,26.33 1.16,26.33 | LED17.C 3.06,32.42 1.16,32.42 | LED9.C 3.01,38.59 1.16,38.59
COL2  (1 unrouted)
  Top 0.305: R49.1 11.43,3.46 LED58.C
COL3  (1 unrouted)
  Top 0.305: LED3.C 15.82,44.92 R14.2
COL4  (1 unrouted)
  Top 0.305: R51.1 23.88,3.46 LED60.C
COL5  (1 unrouted)
  Top 0.305: LED61.C 28,1.92 R52.1
COL6  (via drill 0.36)  (1 unrouted)
  Top 0.254: v36.97,16.42 36.96,16.43 36.34,16.43 36.32,16.45 R41.1
  Top 0.305: R53.1 36.32,3.46 LED62.C | R47.2 36.07,11.96 LED46.C 34.23,14.37 R41.1
  Bottom 0.254: IC2.6 39.04,15.91 38.53,16.42 v36.97,16.42
COL7  (via drill 0.36)  (2 unrouted)
  Top 0.254: v40.46,14.72 40.46,13.79 40.44,13.77
  Top 0.305: R54.1 38.35,3.46 LED63.C | R42.1 38.35,15.9 LED47.C 40.22,13.81 R48.2
  Bottom 0.254: IC2.7 39.53,14 39.52,14.01 39.52,14.12 39.74,14.34 40.08,14.34 v40.46,14.72
COL8  (via drill 0.36)
  Top 0.254: v46.66,12.69 46.66,13.78 LED48.C
  Top 0.305: LED8.C 47.53,44.92 48.35,44.11 48.35,38.7 | 48.35,7.56 48.35,2.3 48.36,2.29 47.44,1.36 LED64.C | 48.35,13.59 48.35,7.56 | 48.35,13.59 48.35,19.86 | 48.35,19.86 48.35,26.1 | 48.35,26.1 48.35,32.48 | LED56.C 46.75,7.56 48.35,7.56 | LED48.C 46.9,13.59 48.35,13.59 | LED32.C 46.83,26.1 48.35,26.1 | LED40.C 46.67,19.86 48.35,19.86 | 48.35,38.7 LED16.C | 48.35,32.48 LED24.C | 48.35,32.48 48.35,38.7
  Bottom 0.254: IC2.8 45.71,13.64 v46.66,12.69
D+
  Bottom 0.305: USB1.D+ 10.82,10.72 arc90 IC3.3
D-
  Bottom 0.305: USB1.D- 11.17,9.92 arc-90 IC3.2
GND  (4 unrouted)
  pour Bottom: -3.09,52.86 52.95,52.86 52.95,-3.21 -3.09,-3.21
  pour Top: -2.88,52.87 52.97,52.87 52.97,-3.19 -2.88,-3.19
INT1/DRDY  (1 unrouted)
IO1
  Bottom 0.305: IC3.7 17.53,9.85 17.88,10.21 IC1.26 | IC1.26
IO2
  Bottom 0.305: IC3.6 19.03,11.12 IC1.27
IREF  (1 unrouted)
LINE1  (1 unrouted)
  Top 0.406: LED1.A LED2.A LED3.A LED4.A LED5.A LED6.A LED7.A LED8.A
LINE2  (1 unrouted)
  Top 0.203: LED10.A LED11.A LED12.A LED13.A LED14.A LED15.A
  Top 0.406: LED10.A LED9.A | LED15.A LED16.A
LINE3  (1 unrouted)
  Top 0.203: LED18.A LED19.A LED20.A LED21.A LED22.A LED23.A
  Top 0.406: LED17.A 3.13,35.98 4.76,37.6 6.82,37.6 8.45,35.98 LED18.A | LED24.A 46.14,36.51 45.8,36.51 44.68,37.63 42.93,37.63 42.23,36.93 42.23,36.36 41.84,35.98 LED23.A
LINE4  (1 unrouted)
  Top 0.203: LED26.A LED27.A LED28.A LED29.A LED30.A LED31.A
  Top 0.406: LED26.A LED25.A | LED31.A LED32.A
LINE5  (1 unrouted)
  Top 0.203: LED34.A LED35.A LED36.A LED37.A LED38.A LED39.A
  Top 0.406: LED34.A LED33.A | LED39.A 40.5,23.58 LED40.A
LINE6  (1 unrouted)
  Top 0.203: 9.35,17.31 LED43.A LED44.A LED45.A LED46.A LED47.A
  Top 0.406: LED41.A 3.12,17.29 LED42.A 9.35,17.31 | LED47.A LED48.A
LINE7  (1 unrouted)
  Top 0.203: LED50.A LED51.A LED52.A | LED53.A LED52.A | 28,11.08 LED54.A LED55.A
  Top 0.406: LED50.A LED49.A | LED52.A | 28,11.08 LED53.A | LED55.A 40.45,11.13 LED56.A
LINE8  (1 unrouted)
  Top 0.203: LED58.A LED59.A LED60.A LED61.A LED62.A LED63.A
  Top 0.406: LED64.A LED63.A | LED58.A LED57.A
MISO
  Bottom 0.203: IC1.16 25.69,4.83
  Bottom 0.305: JP1.2 24.52,3.66 25.69,4.83 | IC1.16
MOSI
  Bottom 0.305: JP1.1 26.76,2.71 26.76,4.24 26.49,4.51 IC1.15
N$1  (1 unrouted)
N$2  (1 unrouted)
N$3  (3 unrouted)
N$4  (1 unrouted)
N$6  (1 unrouted)
N$7  (2 unrouted)
N$8  (2 unrouted)
N$9
  Top 0.305: LED2.C 9.57,44.92 R13.2
N$10
  Top 0.305: R13.1 11.43,40.8 LED10.C 9.56,38.7 R19.2
N$11  (1 unrouted)
N$12
  Top 0.305: R19.1 11.43,34.57 LED18.C 9.57,32.48 R25.2
N$13
  Top 0.305: R25.1 11.43,28.35 LED26.C 9.57,26.25 R31.2
N$14
  Top 0.305: R31.1 11.43,22.13 LED34.C 9.56,20.03 R37.2
N$15
  Top 0.305: R37.1 11.43,15.89 LED42.C 9.57,13.79 R43.2
N$16
  Top 0.305: R43.1 11.43,9.68 LED50.C 9.57,7.58 R49.2
N$17
  Top 0.305: R50.1 17.68,3.48 LED59.C
N$18
  Top 0.305: R44.1 17.68,9.71 LED51.C 15.81,7.58 R50.2
N$19
  Top 0.305: R38.1 17.68,15.93 LED43.C 15.81,13.81 R44.2
N$20
  Top 0.305: R26.1 17.68,22.15 LED35.C 15.82,20.03 R38.2
N$21
  Top 0.305: R21.1 17.68,28.37 LED27.C 15.82,26.25 R26.2
N$22
  Top 0.305: R20.1 17.68,34.6 LED19.C 15.82,32.48 R21.2
N$23  (1 unrouted)
N$24
  Top 0.305: R14.1 17.68,40.8 LED11.C 15.81,38.7 R20.2
N$25
  Top 0.305: LED4.C 22.01,44.92 R15.2
N$26
  Top 0.305: R15.1 23.88,40.8 LED12.C 22.02,38.7 R22.2
N$27
  Top 0.305: R22.1 23.88,34.57 LED20.C 22.01,32.48 R27.2
N$28
  Top 0.305: R27.1 23.88,28.35 LED28.C 22.01,26.25 R32.2
N$29
  Top 0.305: R32.1 23.88,22.13 LED36.C 22.01,20.03 R39.2
N$30
  Top 0.305: R39.1 23.88,15.9 LED44.C 21.99,13.81 R45.2
N$31
  Top 0.305: R45.1 23.88,9.68 LED52.C 22.01,7.58 R51.2
N$32
  Top 0.305: LED5.C 28.22,44.92 R16.2
N$33
  Top 0.305: R16.1 30.1,40.8 LED13.C 28.24,38.7 R23.2
N$34  (1 unrouted)
N$35
  Top 0.305: R23.1 30.1,34.57 LED21.C 29.87,30.61 R28.2
N$36
  Top 0.305: R28.1 30.1,28.35 LED29.C 28.24,26.25 R33.2
N$37
  Top 0.305: R33.1 30.1,22.13 LED37.C 28.23,20.03 R40.2
N$38
  Top 0.305: R40.1 30.1,15.9 LED45.C 28.23,13.81 R46.2
N$39
  Top 0.305: R46.1 30.1,9.67 LED53.C 28.24,7.57 R52.2
N$40
  Top 0.305: LED6.C 34.46,44.92 R17.2
N$41
  Top 0.305: R17.1 34.23,39.27 LED14.C 36.1,36.83 R24.2
N$42
  Top 0.305: R24.1 34.23,33.03 LED22.C 36.1,30.61 R29.2
N$43
  Top 0.305: R34.2 36.1,24.38 LED30.C 34.23,26.81 R29.1
N$44
  Top 0.305: R41.2 36.1,18.16 LED38.C 34.23,20.59 R34.1
N$45  (1 unrouted)
N$47
  Top 0.305: R53.2 36.11,5.7 LED54.C 34.23,8.17 R47.1
N$48
  Top 0.305: LED7.C 40.19,44.92 R18.2
N$49
  Top 0.305: R18.1 38.35,40.8 LED15.C 40.22,38.7 R36.2
N$50
  Top 0.305: R36.1 38.35,34.57 LED23.C 40.22,32.48 R30.2
N$51
  Top 0.305: R30.1 38.35,28.35 LED31.C 40.21,26.25 R35.2
N$52
  Top 0.305: R35.1 38.35,22.13 LED39.C 40.19,20.03 R42.2
N$54
  Top 0.305: R48.1 38.35,9.68 LED55.C 40.22,7.58 R54.2
N$55  (1 unrouted)
N$56  (1 unrouted)
N$57  (1 unrouted)
N$67  (1 unrouted)
N$78  (1 unrouted)
ROW1  (1 unrouted)
ROW2  (1 unrouted)
ROW3  (1 unrouted)
ROW4  (1 unrouted)
ROW5  (1 unrouted)
ROW6  (1 unrouted)
ROW7  (1 unrouted)
ROW8  (1 unrouted)
RST  (2 unrouted)
SCK
  Bottom 0.305: JP1.3 21.98,3.42 22.11,3.54 22.97,3.54 23.9,4.47 24.21,4.47 24.88,5.14 24.88,6.05 IC1.17
SCL/SPC  (1 unrouted)
SCLK
  Bottom 0.254: IC2.31 34.07,12.57 33.66,12.57 33.62,12.61 IC1.5
SDA/SDI/SDO  (1 unrouted)
SDO  (1 unrouted)
SIN
  Bottom 0.254: IC2.32 34.07,13.07 33.71,13.07 33.36,13.41 IC1.4
SWITCH  (1 unrouted)
USB_GND
  Bottom 0.305: IC3.4 8.62,12.39 arc90 USB1.GND
VBUS  (1 unrouted)
  Bottom 0.305: USB1.VBUS arc90 9.08,8.59
VCC  (26 unrouted)
  Bottom 0.305: JP1.4 19.44,5.17 D1.C 19.19,5.28 19.94,4.53 22.75,4.53 23.2,4.99 23.2,5.97 IC1.19
XLAT
  Bottom 0.254: 34.07,10.07 IC2.26 32.26,10.07 31.42,10.91 30.78,10.87 IC1.7